# Altium schematic sheet Storage.SchDoc: Storage
size A4
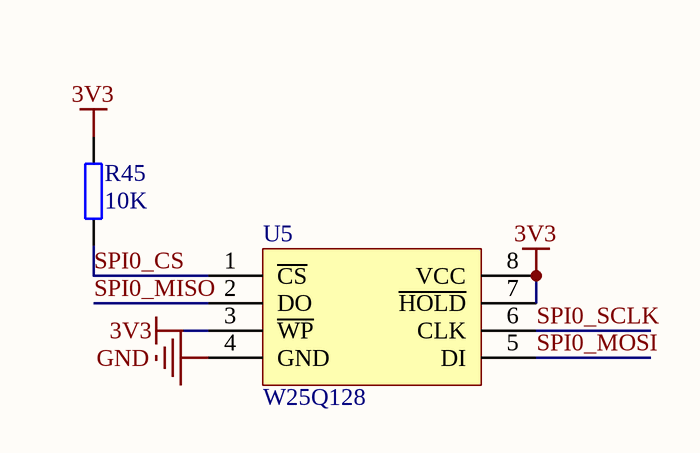
[diagram p0: Storage.SchDoc]

## Parts
R45  10K  [RES-0603]
U5  W25Q128  [LC-SOP-8_208mil]

## Nets
3V3: R45.2 U5.3(~{WP}) U5.7(~{HOLD}) U5.8(VCC)
GND: U5.4(GND)
SPI0_CS: R45.1 U5.1(~{CS})
SPI0_MISO: U5.2(DO)
SPI0_MOSI: U5.5(DI)
SPI0_SCLK: U5.6(CLK)

## Notes on the sheet
- Title
- Size:
- Date:
- A4
- Number:
- Time:
- Revision:
- Sheet
- of
- File:

## Library data of the parts
R45 = R_0603: 贴片电阻0603; tolerance: 5%; voltage: 50V; power: 0.063W; R_value: 10K
U5 = W25Q128: 128Mbits SPI Flash